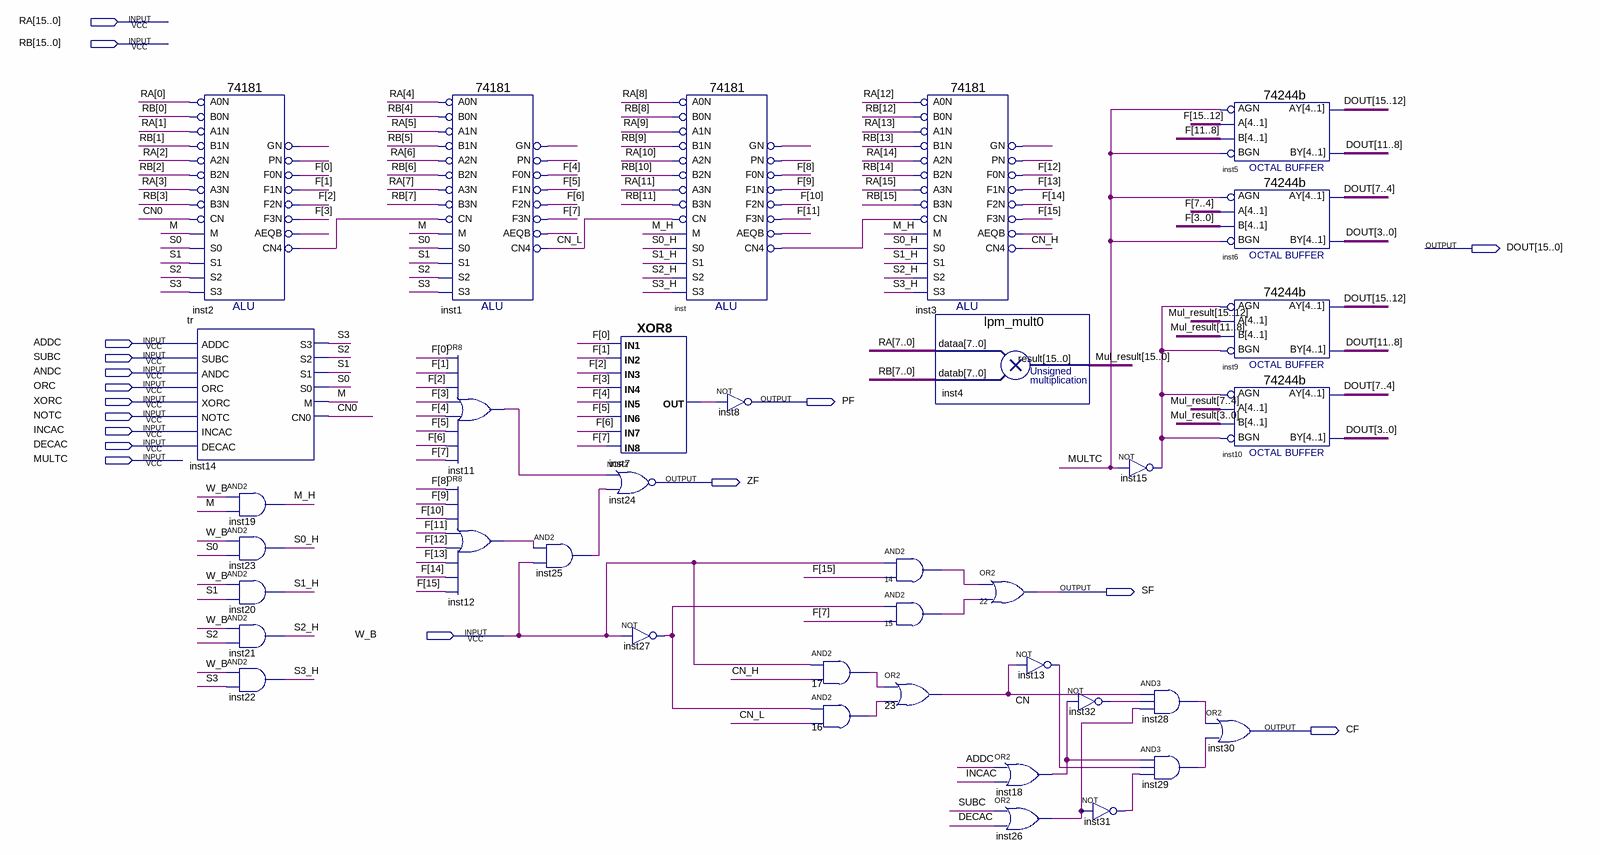
[diagram p0: schematic sheet]
// Quartus schematic ALU.bdf as structural Verilog: 37 symbols, 17 pins
module ALU (
  input  [15:0] RA,
  input  [15:0] RB,
  input  ADDC,
  input  SUBC,
  input  ANDC,
  input  ORC,
  input  XORC,
  input  NOTC,
  input  INCAC,
  input  DECAC,
  input  MULTC,
  input  W_B,
  output [15:0] DOUT,
  output PF,
  output ZF,
  output SF,
  output CF
);

  wire CN, CN0, CN_H, CN_L, inst1_aeqb, inst1_gn, inst1_pn, inst2_aeqb, inst2_cn4, inst2_gn, inst2_pn,
       inst3_aeqb, inst3_gn, inst3_pn, inst7_out, inst11_out, inst12_out, inst13_out, inst15_out, inst18_out,
       inst25_out, inst26_out, inst27_out, inst28_out, inst29_out, inst31_out, inst32_out, inst_aeqb,
       inst_cn4, inst_gn, inst_pn, M, M_H, n14_out, n15_out, n16_out, n17_out, S0, S0_H, S1, S1_H, S2, S2_H,
       S3, S3_H;
  wire [15:0] F, Mul_result;

  \74181  inst2 (
    .B0N(RB[0]), .A0N(RA[0]), .A1N(RA[1]), .B1N(RB[1]), .A3N(RA[3]), .B2N(RB[2]), .A2N(RA[2]), .M(M),
    .CN(CN0), .B3N(RB[3]), .S2(S2), .S1(S1), .S0(S0), .S3(S3), .PN(inst2_pn), .GN(inst2_gn), .F3N(F[3]),
    .F1N(F[1]), .F0N(F[0]), .AEQB(inst2_aeqb), .CN4(inst2_cn4), .F2N(F[2]));
  tr inst14 (
    .ADDC(ADDC), .SUBC(SUBC), .ANDC(ANDC), .ORC(ORC), .XORC(XORC), .NOTC(NOTC), .INCAC(INCAC), .DECAC(DECAC),
    .S3(S3), .S2(S2), .S1(S1), .S0(S0), .M(M), .CN0(CN0));
  and inst19 (M_H, W_B, M);
  and inst23 (S0_H, W_B, S0);
  and inst20 (S1_H, W_B, S1);
  and inst21 (S2_H, W_B, S2);
  and inst22 (S3_H, W_B, S3);
  \74181  inst1 (
    .B0N(RB[4]), .A0N(RA[4]), .A1N(RA[5]), .B1N(RB[5]), .A3N(RA[7]), .B2N(RB[6]), .A2N(RA[6]), .M(M),
    .CN(inst2_cn4), .B3N(RB[7]), .S2(S2), .S1(S1), .S0(S0), .S3(S3), .PN(inst1_pn), .GN(inst1_gn),
    .F3N(F[7]), .F1N(F[5]), .F0N(F[4]), .AEQB(inst1_aeqb), .CN4(CN_L), .F2N(F[6]));
  or inst11 (inst11_out, F[0], F[1], F[2], F[3], F[4], F[5], F[6], F[7]);
  or inst12 (inst12_out, F[8], F[9], F[10], F[11], F[12], F[13], F[14], F[15]);
  and inst25 (inst25_out, inst12_out, W_B);
  XOR8 inst7 (
    .IN8(F[7]), .IN1(F[0]), .IN7(F[6]), .IN6(F[5]), .IN5(F[4]), .IN4(F[3]), .IN3(F[2]), .IN2(F[1]),
    .OUT(inst7_out));
  nor inst24 (ZF, inst11_out, inst25_out);
  not inst27 (inst27_out, W_B);
  \74181  inst (
    .B0N(RB[8]), .A0N(RA[8]), .A1N(RA[9]), .B1N(RB[9]), .A3N(RA[11]), .B2N(RB[10]), .A2N(RA[10]), .M(M_H),
    .CN(CN_L), .B3N(RB[11]), .S2(S2_H), .S1(S1_H), .S0(S0_H), .S3(S3_H), .PN(inst_pn), .GN(inst_gn),
    .F3N(F[11]), .F1N(F[9]), .F0N(F[8]), .AEQB(inst_aeqb), .CN4(inst_cn4), .F2N(F[10]));
  not inst8 (PF, inst7_out);
  and u_17 (n17_out, W_B, CN_H);
  and u_16 (n16_out, inst27_out, CN_L);
  and u_14 (n14_out, W_B, F[15]);
  and u_15 (n15_out, inst27_out, F[7]);
  or u_23 (CN, n17_out, n16_out);
  \74181  inst3 (
    .B0N(RB[12]), .A0N(RA[12]), .A1N(RA[13]), .B1N(RB[13]), .A3N(RA[15]), .B2N(RB[14]), .A2N(RA[14]),
    .M(M_H), .CN(inst_cn4), .B3N(RB[15]), .S2(S2_H), .S1(S1_H), .S0(S0_H), .S3(S3_H), .PN(inst3_pn),
    .GN(inst3_gn), .F3N(F[15]), .F1N(F[13]), .F0N(F[12]), .AEQB(inst3_aeqb), .CN4(CN_H), .F2N(F[14]));
  lpm_mult0 inst4 (.dataa(RA[7:0]), .datab(RB[7:0]), .result(Mul_result));
  or u_22 (SF, n14_out, n15_out);
  not inst13 (inst13_out, CN);
  or inst18 (inst18_out, ADDC, INCAC);
  or inst26 (inst26_out, SUBC, DECAC);
  not inst32 (inst32_out, inst18_out);
  not inst15 (inst15_out, MULTC);
  not inst31 (inst31_out, inst26_out);
  and inst28 (inst28_out, CN, inst32_out, inst26_out);
  and inst29 (inst29_out, inst18_out, inst13_out, inst31_out);
  \74244b  inst5 (.AGN(MULTC), .B(F[11:8]), .BGN(MULTC), .A(F[15:12]), .AY(DOUT[15:12]), .BY(DOUT[11:8]));
  \74244b  inst6 (.AGN(MULTC), .B(F[3:0]), .BGN(MULTC), .A(F[7:4]), .AY(DOUT[7:4]), .BY(DOUT[3:0]));
  \74244b  inst9 (
    .AGN(inst15_out), .B(Mul_result[11:8]), .BGN(inst15_out), .A(Mul_result[15:12]), .AY(DOUT[15:12]),
    .BY(DOUT[11:8]));
  \74244b  inst10 (
    .AGN(inst15_out), .B(Mul_result[3:0]), .BGN(inst15_out), .A(Mul_result[7:4]), .AY(DOUT[7:4]),
    .BY(DOUT[3:0]));
  or inst30 (CF, inst28_out, inst29_out);
endmodule
